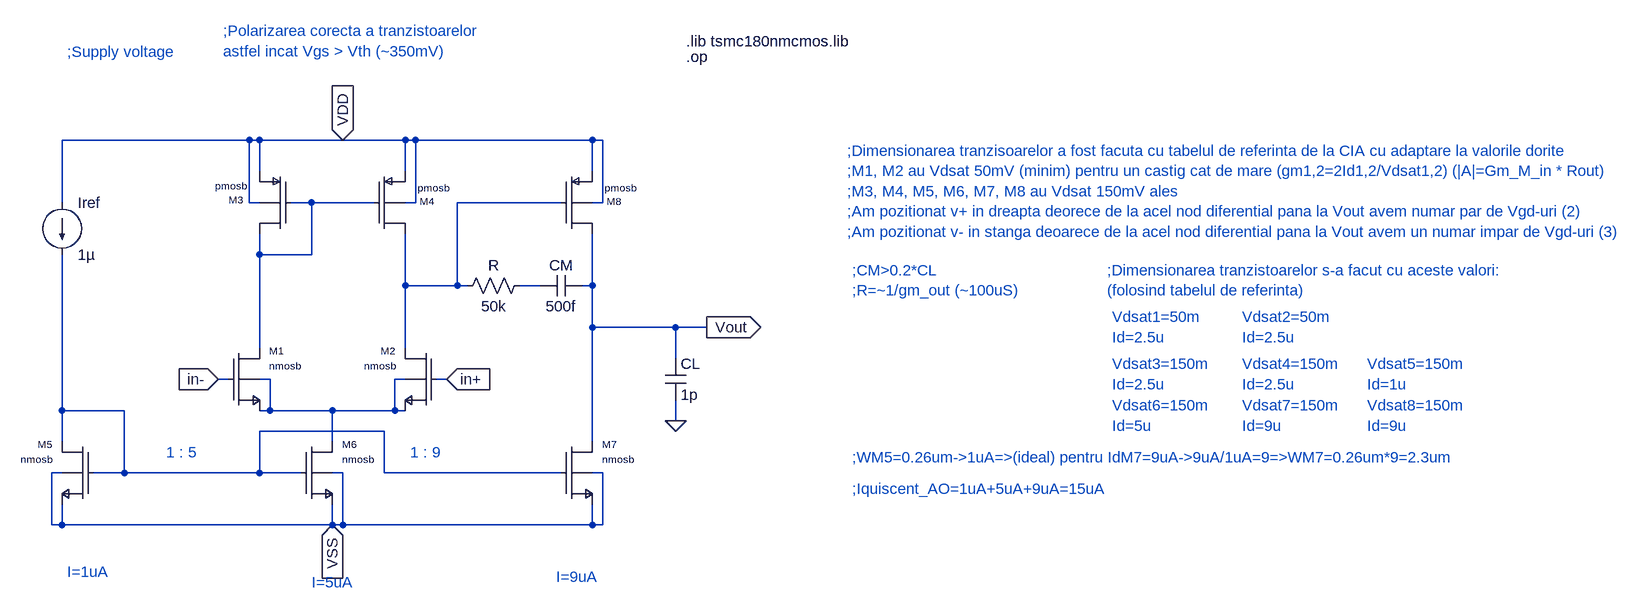
[diagram p0: schematic AO_Miller.asc]
AO_Miller.asc, the LTspice schematic file:
Version 4
SHEET 1 2312 680
WIRE 80 -304 -208 -304
WIRE 96 -304 80 -304
WIRE 224 -304 96 -304
WIRE 320 -304 224 -304
WIRE 336 -304 320 -304
WIRE 608 -304 336 -304
WIRE 624 -304 608 -304
WIRE 96 -256 96 -304
WIRE 320 -256 320 -304
WIRE 608 -256 608 -304
WIRE -208 -208 -208 -304
WIRE 80 -208 80 -304
WIRE 96 -208 80 -208
WIRE 176 -208 144 -208
WIRE 272 -208 176 -208
WIRE 336 -208 336 -304
WIRE 336 -208 320 -208
WIRE 560 -208 400 -208
WIRE 624 -208 624 -304
WIRE 624 -208 608 -208
WIRE 96 -128 96 -160
WIRE 176 -128 176 -208
WIRE 176 -128 96 -128
WIRE 320 -80 320 -160
WIRE 400 -80 400 -208
WIRE 400 -80 320 -80
WIRE 416 -80 400 -80
WIRE 528 -80 496 -80
WIRE 608 -80 608 -160
WIRE 608 -80 592 -80
WIRE 608 -16 608 -80
WIRE 736 -16 608 -16
WIRE 784 -16 736 -16
WIRE 96 16 96 -128
WIRE 320 16 320 -80
WIRE 736 32 736 -16
WIRE 48 64 32 64
WIRE 112 64 96 64
WIRE 320 64 304 64
WIRE 384 64 368 64
WIRE -208 112 -208 -128
WIRE -112 112 -208 112
WIRE 112 112 112 64
WIRE 112 112 96 112
WIRE 208 112 112 112
WIRE 304 112 304 64
WIRE 304 112 208 112
WIRE 320 112 304 112
WIRE 736 128 736 96
WIRE 288 144 96 144
WIRE -208 160 -208 112
WIRE 208 160 208 112
WIRE 608 160 608 -16
WIRE -208 208 -224 208
WIRE -112 208 -112 112
WIRE -112 208 -160 208
WIRE 96 208 96 144
WIRE 96 208 -112 208
WIRE 160 208 96 208
WIRE 224 208 208 208
WIRE 288 208 288 144
WIRE 560 208 288 208
WIRE 624 208 608 208
WIRE -224 288 -224 208
WIRE -208 288 -208 256
WIRE -208 288 -224 288
WIRE 208 288 208 256
WIRE 208 288 -208 288
WIRE 224 288 224 208
WIRE 224 288 208 288
WIRE 608 288 608 256
WIRE 608 288 224 288
WIRE 624 288 624 208
WIRE 624 288 608 288
FLAG 384 64 in+
IOPIN 384 64 In
FLAG 32 64 in-
IOPIN 32 64 In
FLAG 224 -304 VDD
IOPIN 224 -304 In
FLAG 784 -16 Vout
IOPIN 784 -16 Out
FLAG 208 288 VSS
IOPIN 208 288 In
FLAG 736 128 0
SYMBOL nmosb 48 16 R0
WINDOW 0 63 4 Left 1
WINDOW 3 63 27 Left 1
SYMATTR InstName M1
SYMATTR Value2 l=1u w=5.76u
SYMBOL nmosb 368 16 M0
WINDOW 0 63 4 Left 1
WINDOW 3 63 27 Left 1
SYMATTR InstName M2
SYMATTR Value2 l=1u w=5.76u
SYMBOL current -208 -208 R0
WINDOW 123 0 0 Left 0
WINDOW 39 0 0 Left 0
SYMATTR InstName Iref
SYMATTR Value 1µ
SYMBOL nmosb 160 160 R0
WINDOW 0 63 4 Left 1
WINDOW 3 63 27 Left 1
SYMATTR InstName M6
SYMATTR Value2 l=1u w=1.3u
SYMBOL nmosb -160 160 M0
WINDOW 0 63 4 Left 1
WINDOW 3 63 27 Left 1
SYMATTR InstName M5
SYMATTR Value2 l=1u w=0.26u
SYMBOL pmosb 144 -256 M0
WINDOW 0 73 44 Left 1
WINDOW 3 68 22 Left 1
SYMATTR InstName M3
SYMATTR Value2 l=1u w=2.19u
SYMBOL pmosb 272 -256 R0
WINDOW 0 70 46 Left 1
WINDOW 3 67 25 Left 1
SYMATTR InstName M4
SYMATTR Value2 l=1u w=2.19u
SYMBOL pmosb 560 -256 R0
WINDOW 0 70 46 Left 1
WINDOW 3 67 25 Left 1
SYMATTR InstName M8
SYMATTR Value2 l=1u w=7.89u
SYMBOL nmosb 560 160 R0
WINDOW 0 63 4 Left 1
WINDOW 3 63 27 Left 1
SYMATTR InstName M7
SYMATTR Value2 l=1u w=2.3u
SYMBOL cap 720 32 R0
SYMATTR InstName CL
SYMATTR Value 1p
SYMBOL res 512 -96 R90
WINDOW 0 0 56 VBottom 2
WINDOW 3 32 56 VTop 2
SYMATTR InstName R
SYMATTR Value 50k
SYMBOL cap 592 -96 R90
WINDOW 0 0 32 VBottom 2
WINDOW 3 32 32 VTop 2
SYMATTR InstName CM
SYMATTR Value 500f
TEXT 752 -456 Left 2 !.lib tsmc180nmcmos.lib
TEXT -48 176 Left 2 ;1 : 5
TEXT 1008 184 Left 2 ;;WM5=0.26um->1uA=>(ideal) pentru IdM7=9uA->9uA/1uA=9=>WM7=0.26um*9=2.3um
TEXT 1800 40 Left 2 ;Vdsat5=150m\nId=1u
TEXT -200 360 Left 2 ;I=1uA
TEXT 176 376 Left 2 ;I=5uA
TEXT 552 368 Left 2 ;I=9uA
TEXT 1008 232 Left 2 ;;Iquiscent_AO=1uA+5uA+9uA=15uA
TEXT 328 176 Left 2 ;1 : 9
TEXT 40 -472 Left 2 ;;Polarizarea corecta a tranzistoarelor\nastfel incat Vgs > Vth (~350mV)
TEXT 1408 -32 Left 2 ;Vdsat1=50m\nId=2.5u
TEXT 1608 -32 Left 2 ;Vdsat2=50m\nId=2.5u
TEXT 1408 40 Left 2 ;Vdsat3=150m\nId=2.5u
TEXT 1608 40 Left 2 ;Vdsat4=150m\nId=2.5u
TEXT 1800 104 Left 2 ;Vdsat8=150m\nId=9u
TEXT 1608 104 Left 2 ;Vdsat7=150m\nId=9u
TEXT 1408 104 Left 2 ;Vdsat6=150m\nId=5u
TEXT 1000 -288 Left 2 ;;Dimensionarea tranzisoarelor a fost facuta cu tabelul de referinta de la CIA cu adaptare la valorile dorite\n;M1, M2 au Vdsat 50mV (minim) pentru un castig cat de mare (gm1,2=2Id1,2/Vdsat1,2) (|A|=Gm_M_in * Rout)\n;M3, M4, M5, M6, M7, M8 au Vdsat 150mV ales\n;Am pozitionat v+ in dreapta deorece de la acel nod diferential pana la Vout avem numar par de Vgd-uri (2)\n;Am pozitionat v- in stanga deoarece de la acel nod diferential pana la Vout avem un numar impar de Vgd-uri (3)
TEXT -200 -440 Left 2 ;;Supply voltage
TEXT 1400 -104 Left 2 ;;Dimensionarea tranzistoarelor s-a facut cu aceste valori:\n(folosind tabelul de referinta)
TEXT 752 -432 Left 2 !.op
TEXT 1008 -104 Left 2 ;;CM>0.2*CL\n;R=~1/gm_out (~100uS)

The netlist it stands for:
* AO_Miller.asc
M1 N001 in- N004 N004 nmosb l=1u w=5.76u
M2 N002 in+ N004 N004 nmosb l=1u w=5.76u
Iref VDD N005 1µ
M6 N004 N005 VSS VSS nmosb l=1u w=1.3u
M5 N005 N005 VSS VSS nmosb l=1u w=0.26u
M3 N001 N001 VDD VDD pmosb l=1u w=2.19u
M4 N002 N001 VDD VDD pmosb l=1u w=2.19u
M8 Vout N002 VDD VDD pmosb l=1u w=7.89u
M7 Vout N005 VSS VSS nmosb l=1u w=2.3u
CL Vout 0 1p
R N003 N002 50k
CM Vout N003 500f
.model NMOS NMOS
.model PMOS PMOS
.lib standard.mos
.lib tsmc180nmcmos.lib
* 1 : 5
* ;WM5=0.26um->1uA=>(ideal) pentru IdM7=9uA->9uA/1uA=9=>WM7=0.26um*9=2.3um
* Vdsat5=150m
* Id=1u
* I=1uA
* I=5uA
* I=9uA
* ;Iquiscent_AO=1uA+5uA+9uA=15uA
* 1 : 9
* ;Polarizarea corecta a tranzistoarelor
* astfel incat Vgs > Vth (~350mV)
* Vdsat1=50m
* Id=2.5u
* Vdsat2=50m
* Id=2.5u
* Vdsat3=150m
* Id=2.5u
* Vdsat4=150m
* Id=2.5u
* Vdsat8=150m
* Id=9u
* Vdsat7=150m
* Id=9u
* Vdsat6=150m
* Id=5u
* ;Dimensionarea tranzisoarelor a fost facuta cu tabelul de referinta de la CIA cu adaptare la valorile dorite
* ;M1, M2 au Vdsat 50mV (minim) pentru un castig cat de mare (gm1,2=2Id1,2/Vdsat1,2) (|A|=Gm_M_in * Rout)
* ;M3, M4, M5, M6, M7, M8 au Vdsat 150mV ales
* ;Am pozitionat v+ in dreapta deorece de la acel nod diferential pana la Vout avem numar par de Vgd-uri (2)
* ;Am pozitionat v- in stanga deoarece de la acel nod diferential pana la Vout avem un numar impar de Vgd-uri (3)
* ;Supply voltage
* ;Dimensionarea tranzistoarelor s-a facut cu aceste valori:
* (folosind tabelul de referinta)
.op
* ;CM>0.2*CL
* ;R=~1/gm_out (~100uS)
.backanno
.end